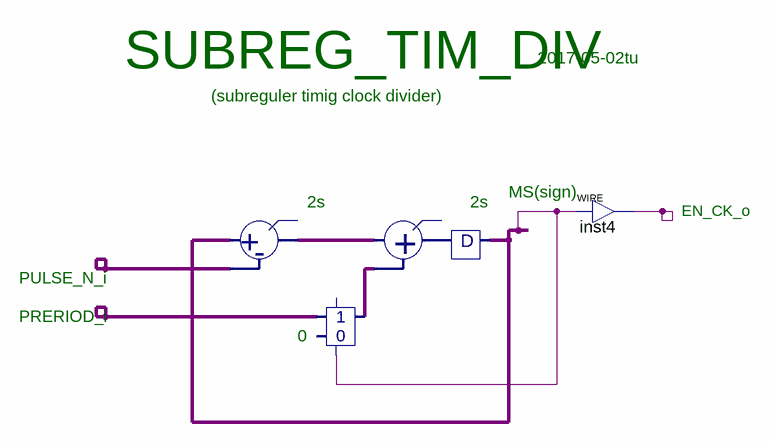
[diagram p0: schematic sheet]
// Quartus schematic SUBREG_TIM_DIV.bdf as structural Verilog: 5 symbols, 0 pins
module SUBREG_TIM_DIV (
);

  wire inst4_out, undriven, undriven_2, undriven_3;
  wire [7:0] inst1_y, inst2_y, inst3_y, inst_y;

  sub inst1 (.A(inst2_y), .B(undriven_3), .Y(inst1_y));  // open: cy
  \2_1sel  inst3 (.A(undriven_2), .S1(undriven), .Y(inst3_y));  // open: B, S0
  add inst (.A(inst1_y), .B(inst3_y), .Y(inst_y));  // open: cy
  D inst2 (.A(inst_y), .Y(inst2_y));
  assign inst4_out = undriven;  // WIRE inst4

  // Notes on the sheet:
  //   SUBREG_TIM_DIV
  //   2017-05-02tu
  //   (subreguler timig clock divider)
  //   MS(sign)
  //   2s
  //   2s
  //   EN_CK_o
  //   PULSE_N_i
  //   PRERIOD_i
  //   0
endmodule
